# EAGLE design W050B (EAGLE 6.6.0)
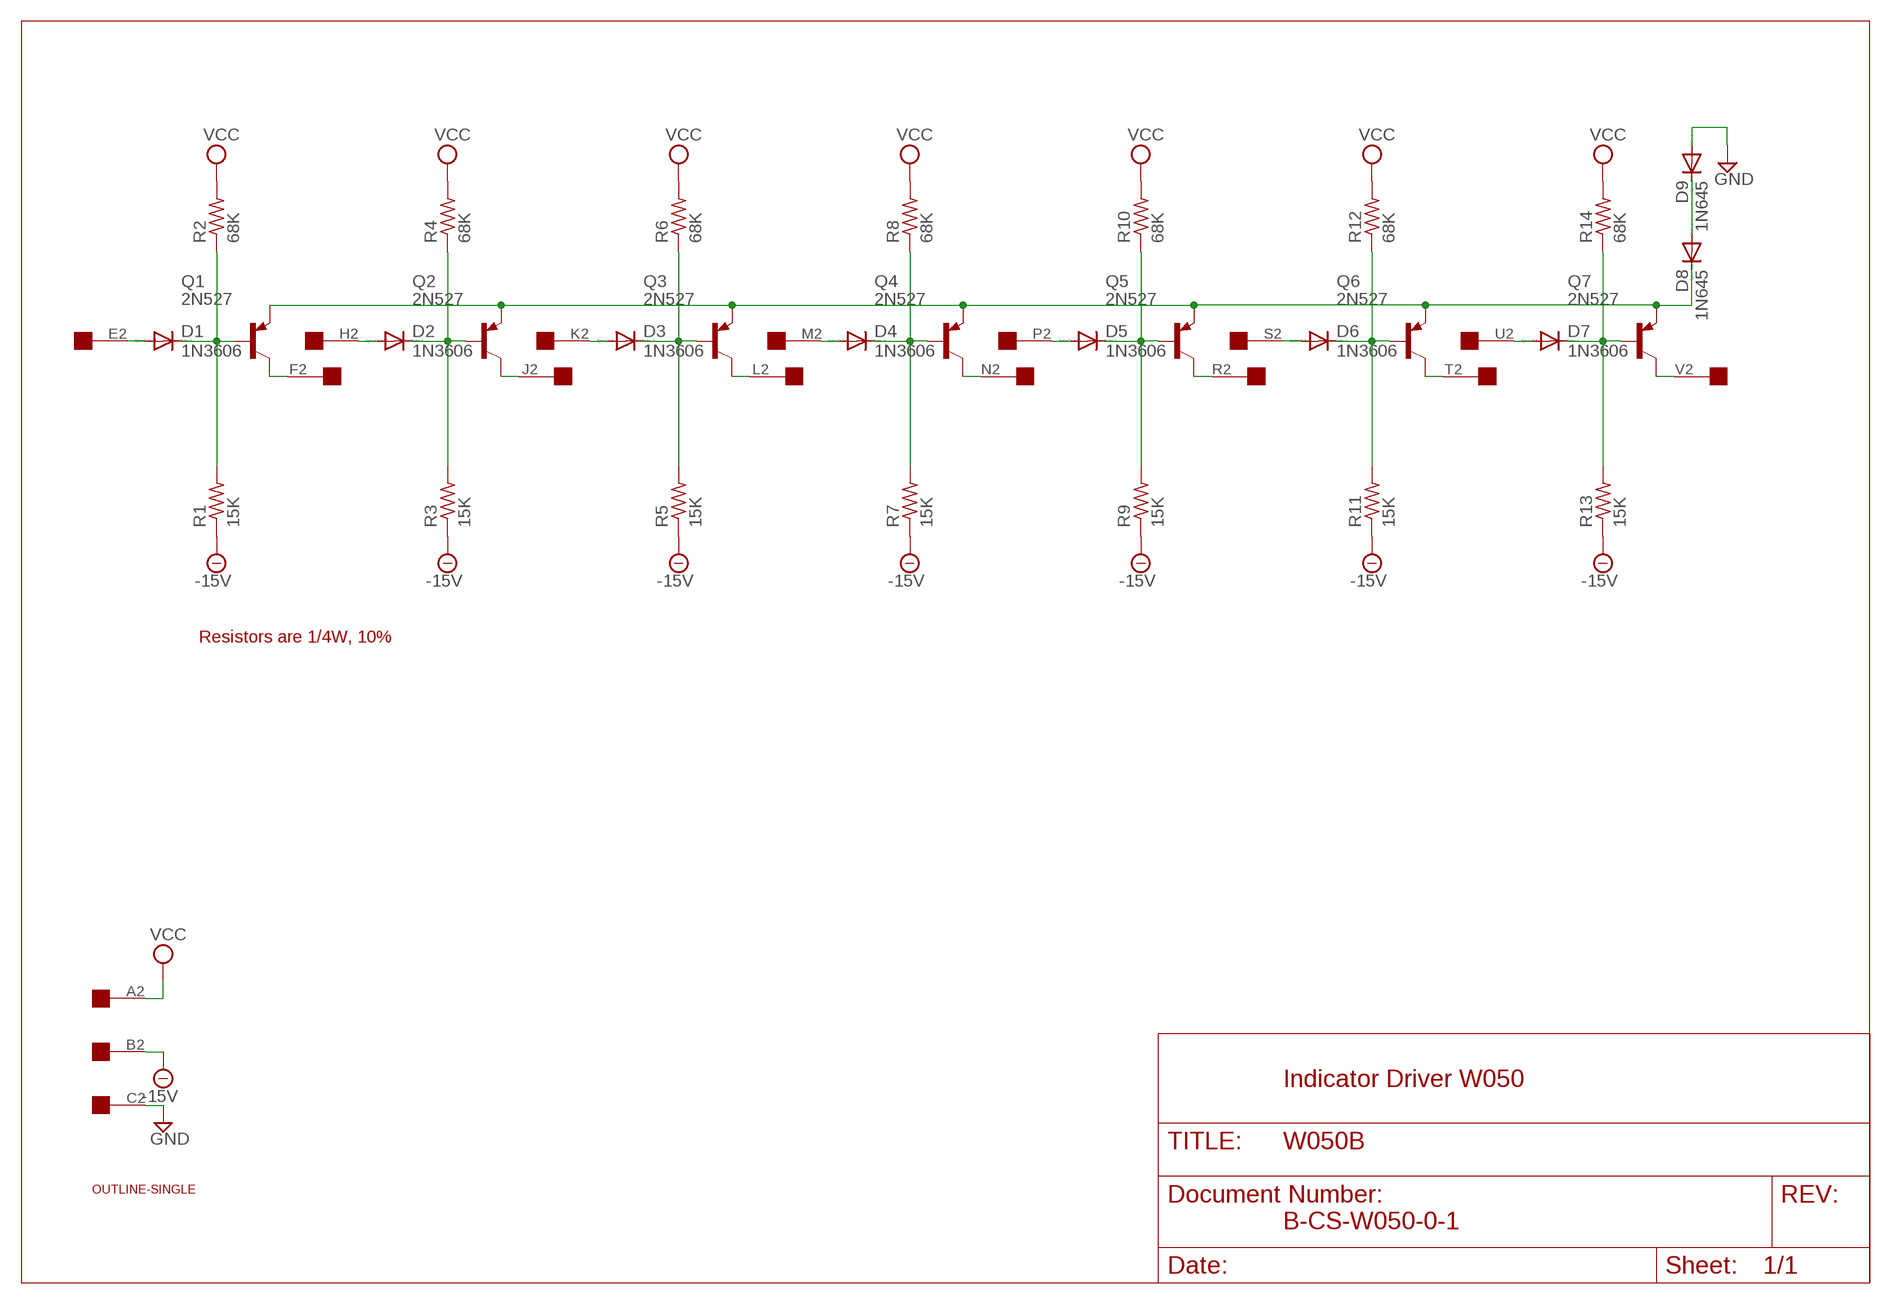
[diagram p0: schematic, sheet 1]

## Parts
D1  1N3606  DIODE-DO35-10  [DO35-10]
D2  1N3606  DIODE-DO35-10  [DO35-10]
D3  1N3606  DIODE-DO35-10  [DO35-10]
D4  1N3606  DIODE-DO35-10  [DO35-10]
D5  1N3606  DIODE-DO35-10  [DO35-10]
D6  1N3606  DIODE-DO35-10  [DO35-10]
D7  1N3606  DIODE-DO35-10  [DO35-10]
D8  1N645  1N4148DO35-10  [DO35-10]
D9  1N645  1N4148DO35-10  [DO35-10]
EDGE  EDGE-1  [EDGE-CON1]
Q1  2N527  2N2904  [TO39]
Q2  2N527  2N2904  [TO39]
Q3  2N527  2N2904  [TO39]
Q4  2N527  2N2904  [TO39]
Q5  2N527  2N2904  [TO39]
Q6  2N527  2N2904  [TO39]
Q7  2N527  2N2904  [TO39]
R1  15K  R-US_0207/10  [0207/10]
R2  68K  R-US_0207/10  [0207/10]
R3  15K  R-US_0207/10  [0207/10]
R4  68K  R-US_0207/10  [0207/10]
R5  15K  R-US_0207/10  [0207/10]
R6  68K  R-US_0207/10  [0207/10]
R7  15K  R-US_0207/10  [0207/10]
R8  68K  R-US_0207/10  [0207/10]
R9  15K  R-US_0207/10  [0207/10]
R10  68K  R-US_0207/10  [0207/10]
R11  15K  R-US_0207/10  [0207/10]
R12  68K  R-US_0207/10  [0207/10]
R13  15K  R-US_0207/10  [0207/10]
R14  68K  R-US_0207/10  [0207/10]
U$1  OUTLINE-SINGLE  [SINGLE]

## Nets
-15V [Supply]: EDGE.B2 R1.1 R3.1 R5.1 R7.1 R9.1 R11.1 R13.1
GND [Supply]: D9.A EDGE.C2
N$1: D1.C Q1.2(B) R1.2 R2.1
N$2 [Supply]: EDGE.F2 Q1.3(C)
N$3: D1.A EDGE.E2
N$4: D2.C Q2.2(B) R3.2 R4.1
N$5 [Supply]: EDGE.J2 Q2.3(C)
N$6: D6.A EDGE.S2
N$7: D4.C Q4.2(B) R7.2 R8.1
N$8 [Supply]: EDGE.N2 Q4.3(C)
N$9: D7.A EDGE.U2
N$10: D3.C Q3.2(B) R5.2 R6.1
N$11 [Supply]: EDGE.L2 Q3.3(C)
N$12: D5.A EDGE.P2
N$13: D5.C Q5.2(B) R9.2 R10.1
N$14 [Supply]: EDGE.R2 Q5.3(C)
N$15: D4.A EDGE.M2
N$16: D6.C Q6.2(B) R11.2 R12.1
N$17 [Supply]: EDGE.T2 Q6.3(C)
N$18: D3.A EDGE.K2
N$19: D7.C Q7.2(B) R13.2 R14.1
N$20 [Supply]: EDGE.V2 Q7.3(C)
N$21: D2.A EDGE.H2
N$22 [Supply]: D8.C Q1.1(E) Q2.1(E) Q3.1(E) Q4.1(E) Q5.1(E) Q6.1(E) Q7.1(E)
N$23 [Supply]: D8.A D9.C
VCC: EDGE.A2 R2.2 R4.2 R6.2 R8.2 R10.2 R12.2 R14.2
Unconnected: EDGE.D2

## Notes on the sheet
- Resistors are 1/4W, 10%
- Indicator Driver W050
- B-CS-W050-0-1

## Library data of the parts
D1-D7 = diode:DIODE-: DIODE
D8 D9 = diode:1N4148: DIODE high speed (Philips)
EDGE = dec-con:EDGE-1: Single-Sided DEC Edge Connector -- (side 2)
Q1-Q7 = transistor-pnp:2N2904*: PNP Transistror
R1-R14 = rcl:R-US_: RESISTOR, American symbol
U$1 = dec-con:OUTLINE-*: Board outlines for DEC boards.

## Net classes
0 default: width 0.813 mm
1 Supply: width 0.813 mm

## Board
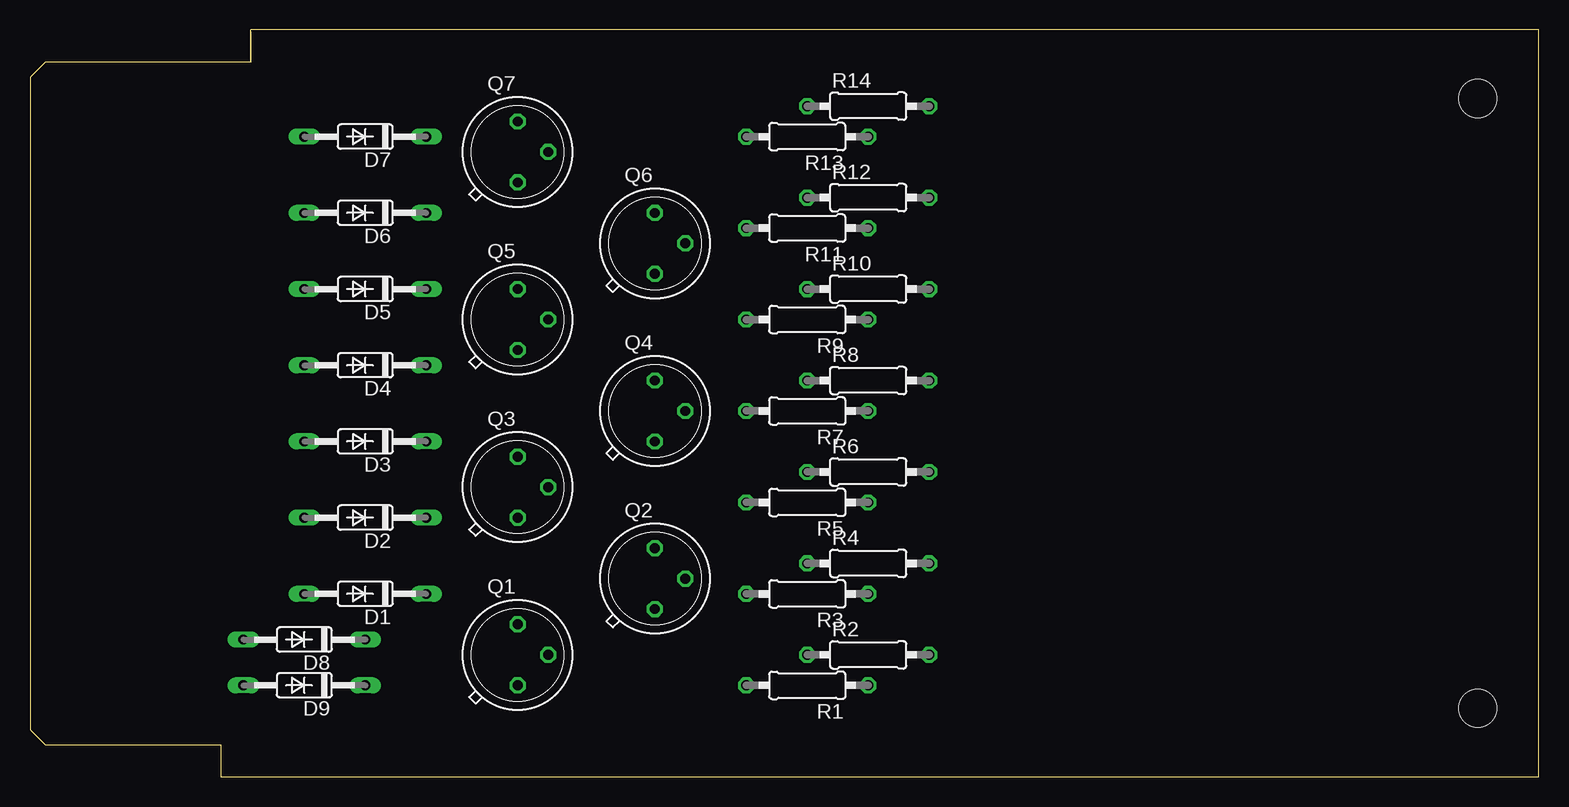
[diagram p1: board, top side]
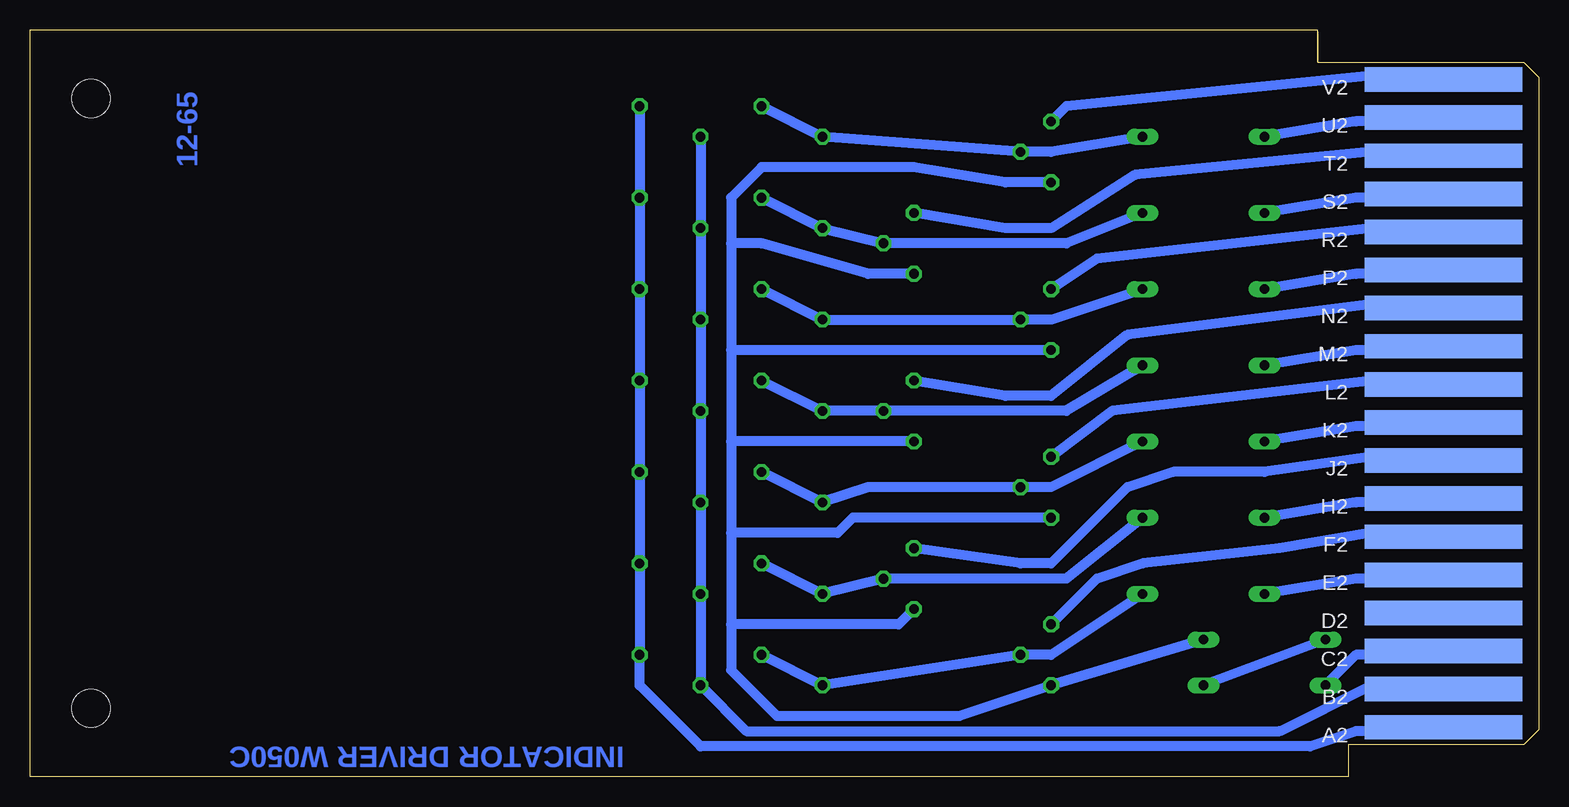
[diagram p2: board, bottom side, seen from below]

Size 125.73 x 62.23 mm. Coordinates in mm from the lower left corner, seen from the top.
Copper layers (1+16): Top 0.035mm / dielectric 1.5mm / Bottom 0.035mm
Design rules "16mils": minimum track width 16mil, minimum drill 32mil, track to track 15mil, track to pad 10mil, pad to pad 10mil, via to via 10mil, smd to smd 10mil, copper to edge 13mil, drill to drill 10mil, minimum pad ring 10mil, minimum via ring 8mil, stop-mask expansion 0mil, vias tented up to drill 0mil, thermal gap 10mil

### Footprints (pad centres in the part's own frame; a part is rotated, then mirrored left to right if it is on the bottom)
DO35-10 = drill 0.813 long: A 5.08,0; C -5.08,0
EDGE-CON1 = smd 13.106 x 2.032 bottom: A2 7.938,4.128; B2 7.938,7.303; C2 7.938,10.477; D2 7.938,13.652; E2 7.938,16.828; F2 7.938,20.003; H2 7.938,23.177; J2 7.938,26.352; K2 7.938,29.527; L2 7.938,32.703; M2 7.938,35.877; N2 7.938,39.053; P2 7.938,42.227; R2 7.938,45.403; S2 7.938,48.578; T2 7.938,51.752; U2 7.938,54.928; V2 7.938,58.102
TO39 = drill 0.813 octagon: 1 0,-2.54; 2 2.54,0; 3 0,2.54
0207/10 = drill 0.813 octagon: 1 -5.08,0; 2 5.08,0
SINGLE = hole 3.175: 120.65,56.515; 120.65,5.715

### Placement (x,y rotation side)
D1  27.94,15.24 180 top
D2  27.94,21.59 180 top
D3  27.94,27.94 180 top
D4  27.94,34.29 180 top
D5  27.94,40.64 180 top
D6  27.94,46.99 180 top
D7  27.94,53.34 180 top
D8  22.86,11.43 180 top
D9  22.86,7.62 180 top
EDGE  0,0 0 top
Q1  40.64,10.16 0 top
Q2  52.07,16.51 0 top
Q3  40.64,24.13 0 top
Q4  52.07,30.48 0 top
Q5  40.64,38.1 0 top
Q6  52.07,44.45 0 top
Q7  40.64,52.07 0 top
R1  64.77,7.62 180 top
R2  69.85,10.16 0 top
R3  64.77,15.24 180 top
R4  69.85,17.78 0 top
R5  64.77,22.86 180 top
R6  69.85,25.4 0 top
R7  64.77,30.48 180 top
R8  69.85,33.02 0 top
R9  64.77,38.1 180 top
R10  69.85,40.64 0 top
R11  64.77,45.72 180 top
R12  69.85,48.26 0 top
R13  64.77,53.34 180 top
R14  69.85,55.88 0 top
U$1  0,0 0 top

### Tracks (layer width: path | path; a pad name or v marks a point on that pad's centre or on a via)
-15V
  Bottom 0.813: R13.1 R11.1 R9.1 R7.1 R5.1 R3.1 R1.1 66.04,3.81 21.59,3.81 13.97,7.62 8.89,7.62 EDGE.B2
GND
  Bottom 0.813: EDGE.C2 8.89,10.16 15.24,10.16 D9.A
N$1
  Bottom 0.813: D1.C 40.64,10.16 Q1.2 R1.2 R2.1
N$2
  Bottom 0.813: EDGE.F2 8.89,20.32 13.97,20.32 21.59,19.05 33.02,17.78 36.83,16.51 Q1.3
N$3
  Bottom 0.813: EDGE.E2 8.89,16.51 15.24,16.51 D1.A
N$4
  Bottom 0.813: R4.1 R3.2 Q2.2 39.37,16.51 D2.C
N$5
  Bottom 0.813: EDGE.J2 10.16,26.67 13.97,26.67 22.86,25.4 30.48,25.4 34.29,24.13 40.64,17.78 43.18,17.78 Q2.3
N$6
  Bottom 0.813: EDGE.S2 8.89,48.26 15.24,48.26 D6.A
N$7
  Bottom 0.813: R8.1 R7.2 Q4.2 39.37,30.48 D4.C
N$8
  Bottom 0.813: EDGE.N2 8.89,39.37 13.97,39.37 34.29,36.83 40.64,31.75 44.45,31.75 Q4.3
N$9
  Bottom 0.813: EDGE.U2 8.89,54.61 15.24,54.61 D7.A
N$10
  Bottom 0.813: D3.C 40.64,24.13 Q3.2 55.88,24.13 R5.2 R6.1
N$11
  Bottom 0.813: EDGE.L2 8.89,33.02 13.97,33.02 35.56,30.48 Q3.3
N$12
  Bottom 0.813: EDGE.P2 8.89,41.91 15.24,41.91 D5.A
N$13
  Bottom 0.813: D5.C 40.64,38.1 Q5.2 R9.2 R10.1
N$14
  Bottom 0.813: EDGE.R2 8.89,45.72 13.97,45.72 36.83,43.18 Q5.3
N$15
  Bottom 0.813: EDGE.M2 10.16,35.56 15.24,35.56 D4.A
N$16
  Bottom 0.813: R12.1 R11.2 Q6.2 39.37,44.45 D6.C
N$17
  Bottom 0.813: EDGE.T2 8.89,52.07 13.97,52.07 33.66,50.16 40.64,45.72 44.45,45.72 Q6.3
N$18
  Bottom 0.813: EDGE.K2 8.89,29.21 15.24,29.21 D3.A
N$19
  Bottom 0.813: R14.1 R13.2 Q7.2 40.64,52.07 D7.C
N$20
  Bottom 0.813: EDGE.V2 8.89,58.42 13.97,58.42 39.37,55.88 Q7.3
N$21
  Bottom 0.813: EDGE.H2 8.89,22.86 15.24,22.86 D2.A
N$22
  Bottom 0.813: Q2.1 53.34,12.7 67.31,12.7 | 67.31,12.7 67.31,8.89 63.5,5.08 48.26,5.08 Q1.1 D8.C | Q6.1 55.88,41.91 64.77,44.45 67.31,44.45 | 67.31,44.45 67.31,35.56 | 67.31,35.56 67.31,27.94 | 67.31,27.94 67.31,20.32 | 67.31,20.32 67.31,12.7 | Q7.1 44.45,49.53 52.07,50.8 64.77,50.8 67.31,48.26 67.31,44.45 | Q5.1 67.31,35.56 | Q3.1 57.15,21.59 58.42,20.32 67.31,20.32 | Q4.1 67.31,27.94
N$23
  Bottom 0.813: D8.A D9.C
VCC
  Bottom 0.813: EDGE.A2 11.43,3.81 15.24,3.81 19.05,2.54 69.85,2.54 74.93,7.62 R2.2 R4.2 R6.2 R8.2 R10.2 R12.2 R14.2

### Text on the board
Bottom: 12-65 | INDICATOR DRIVER W050C
200bmp: C:/Users/Vince/Documents/eagle/projects/DEC/Wxxx/W050/W050Bbackfb.bmp